# Altium schematic sheet Sensors.SchDoc
size A4; SheetNumber: 3; SheetTotal: 5
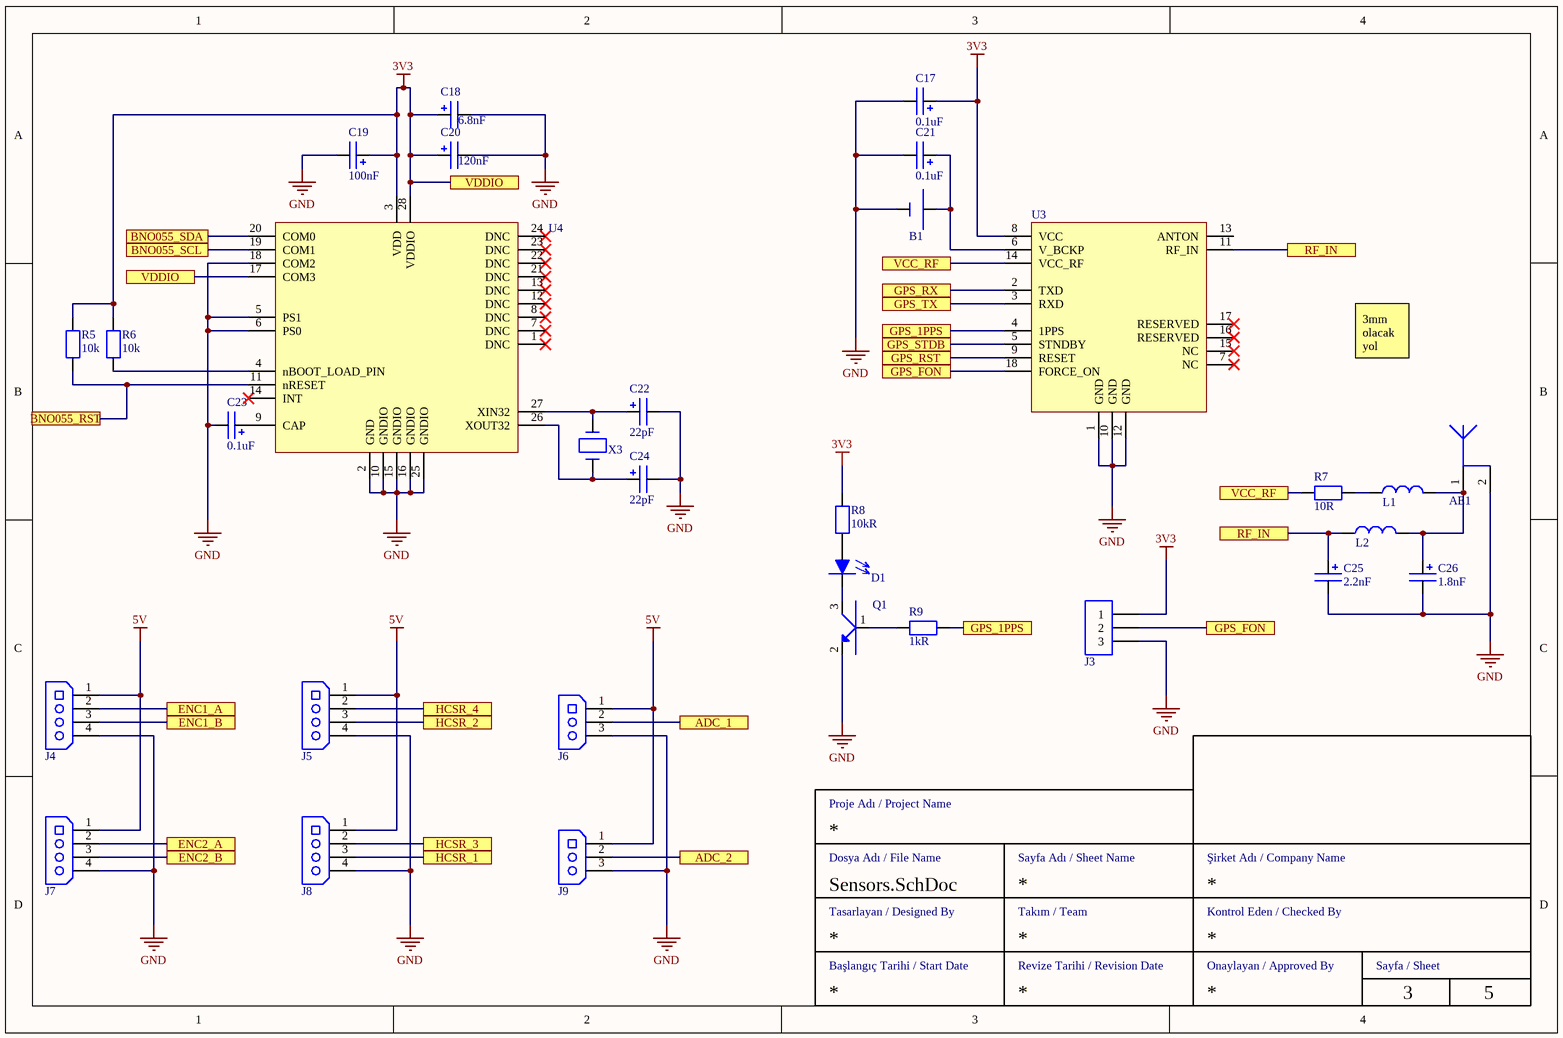
[diagram p0: Sensors.SchDoc]

## Parts
AE1  UFL Connector  [UFL CONN]  (value not drawn)
B1  BH029  [BH029]  (value not drawn)
C17  value 0.1uF  [CAP 0603]  (hidden comment: CAP 0603)
C18  value 6.8nF  [CAP 0603]  (hidden comment: CAP 0603)
C19  value 100nF  [CAP 0603]  (hidden comment: CAP 0603)
C20  value 120nF  [CAP 0603]  (hidden comment: CAP 0603)
C21  value 0.1uF  [CAP 0603]  (hidden comment: CAP 0603)
C22  value 22pF  [CAP 0603]  (hidden comment: CAP 0603)
C23  value 0.1uF  [CAP 0603]  (hidden comment: CAP 0603)
C24  value 22pF  [CAP 0603]  (hidden comment: CAP 0603)
C25  value 2.2nF  [CAP 0603]  (hidden comment: CAP 0603)
C26  value 1.8nF  [CAP 0603]  (hidden comment: CAP 0603)
D1  LTW-C191TLA  [LED 0603]  (value not drawn)
J3  146285-3  [HMATHT00C31]  (value not drawn)
J4  JSTXH4  [JSTXH4]  (value not drawn)
J5  JSTXH4  [JSTXH4]  (value not drawn)
J6  JSTXH3  [JSTXH3]  (value not drawn)
J7  JSTXH4  [JSTXH4]  (value not drawn)
J8  JSTXH4  [JSTXH4]  (value not drawn)
J9  JSTXH3  [JSTXH3]  (value not drawn)
L1  IND 0603  [INDUCTOR 0603]  (value not drawn)
L2  IND 0603  [INDUCTOR 0603]  (value not drawn)
Q1  BC817-40  [SOT23-3]  (value not drawn)
R5  value 10k  [RESISTOR 0603]  (hidden comment: RES 0603)
R6  value 10k  [RESISTOR 0603]  (hidden comment: RES 0603)
R7  value 10R  [RESISTOR 0603]  (hidden comment: RES 0603)
R8  value 10kR  [RESISTOR 0603]  (hidden comment: RES 0603)
R9  value 1kR  [RESISTOR 0603]  (hidden comment: RES 0603)
U3  L76M33  [L76M33]  (value not drawn)
U4  BNO055  [LGA-28]  (value not drawn)
X3  RSM200S-32.768  [4-SOJ]  (value not drawn)

## Ports
ADC_1, ADC_2, BNO055_RST, BNO055_SCL, BNO055_SDA, ENC1_A, ENC1_B, ENC2_A, ENC2_B, GPS_1PPS, GPS_FON, GPS_RST, GPS_RX, GPS_STDB, GPS_TX, HCSR_1, HCSR_2, HCSR_3, HCSR_4, RF_IN, VCC_RF, VDDIO

## Nets
3V3: C17.1 C18.1 C19.1 C20.1 J3.1 R5.2 R6.2 R8.2 U3.8(VCC) U4.3(VDD) U4.17(COM3) U4.28(VDDIO) ; port VDDIO
5V: J4.1 J5.1 J6.1 J7.1 J8.1 J9.1
GND: AE1.2 B1.2 C17.2 C18.2 C19.2 C20.2 C21.2 C22.2 C23.2 C24.2 C25.2 C26.2 J3.3 J4.4 J5.4 J6.3 J7.4 J8.4 J9.3 Q1.2(S) U3.1(GND) U3.10(GND) U3.12(GND) U4.2(GND) U4.5(PS1) U4.6(PS0) U4.10(GNDIO) U4.15(GNDIO) U4.16(GNDIO) U4.18(COM2) U4.25(GNDIO)
ADC_1: J6.2 ; port ADC_1
ADC_2: J9.2 ; port ADC_2
BNO055_RST: R5.1 U4.11(nRESET) ; port BNO055_RST
BNO055_SCL: U4.19(COM1) ; port BNO055_SCL
BNO055_SDA: U4.20(COM0) ; port BNO055_SDA
ENC1_A: J4.2 ; port ENC1_A
ENC1_B: J4.3 ; port ENC1_B
ENC2_A: J7.2 ; port ENC2_A
ENC2_B: J7.3 ; port ENC2_B
GPS_1PPS: R9.2 U3.4(1PPS) ; port GPS_1PPS
GPS_FON: J3.2 U3.18(FORCE_ON) ; port GPS_FON
GPS_RST: U3.9(RESET) ; port GPS_RST
GPS_RX: U3.2(TXD) ; port GPS_RX
GPS_STDB: U3.5(STNDBY) ; port GPS_STDB
GPS_TX: U3.3(RXD) ; port GPS_TX
HCSR_1: J8.3 ; port HCSR_1
HCSR_2: J5.3 ; port HCSR_2
HCSR_3: J8.2 ; port HCSR_3
HCSR_4: J5.2 ; port HCSR_4
RF_IN: C25.1 L2.1 U3.11(RF_IN) ; port RF_IN
VCC_RF: R7.1 U3.14(VCC_RF) ; port VCC_RF
NetAE1_1: AE1.1 C26.1 L1.2 L2.2
NetB1_1: B1.1 C21.1 U3.6(V_BCKP)
NetC22_1: C22.1 U4.27(XIN32) X3.4
NetC23_1: C23.1 U4.9(CAP)
NetC24_1: C24.1 U4.26(XOUT32) X3.1
NetD1_1: D1.1 Q1.3(D)
NetD1_2: D1.2 R8.1
NetL1_1: L1.1 R7.2
NetQ1_1: Q1.1(G) R9.1
NetR6_1: R6.1 U4.4(nBOOT_LOAD_PIN)

Not connected (* = marked no-connect by the designer): U3 7(NC)* 13(ANTON) 15(NC)* 16(RESERVED)* 17(RESERVED)*; U4 1(DNC)* 7(DNC)* 8(DNC)* 12(DNC)* 13(DNC)* 14(INT)* 21(DNC)* 22(DNC)* 23(DNC)* 24(DNC)*

## Notes on the sheet
- 3mm olacak yol
- Dosya Adı / File Name
- Proje Adı / Project Name
- Sayfa Adı / Sheet Name
- Şirket Adı / Company Name
- Tasarlayan / Designed By
- Takım / Team
- Kontrol Eden / Checked By
- Başlangıç Tarihi / Start Date
- Revize Tarihi / Revision Date
- Onaylayan / Approved By
- Sayfa / Sheet

## Library data of the parts
AE1 = UFL Connector: Antenna Connector
B1 = BH029: Battery Holder; Category: Battery Holder
C17-C26 = CAP 0603: Multilayer Ceramic Capacitor; Capacitor Type: MLCC; Case/Package: 0603
D1 = LED 0603: Chip LED; Case/Package: 0603
J3 = HMATHT00C31: Header for PCB
J4 J5 J7 J8 = JSTXH4: JST Socket for PCB
J6 J9 = JSTXH3: JST Socket for PCB
L1 L2 = IND 0603: SMD Inductor
Q1 = BC817-40: Transistor BJT; Transistor Type: NPN; Voltage: 45V; Current: 500mA; Case/Package: SOT23
R5-R9 = RES 0603: SMD Chip Resistor; Case/Package: 0603
U3 = L76M33: GPS, GLONASS, GNSS Transceiver
U4 = BNO055: IMU Sensor; Case/Package: LGA28; Category: Sensor
X3 = RSM200S-32.768: CRYSTAL; Capacitance: 12.5pF